# EAGLE design 1W_FM_TRX_DRA818V (EAGLE 9.4.2)
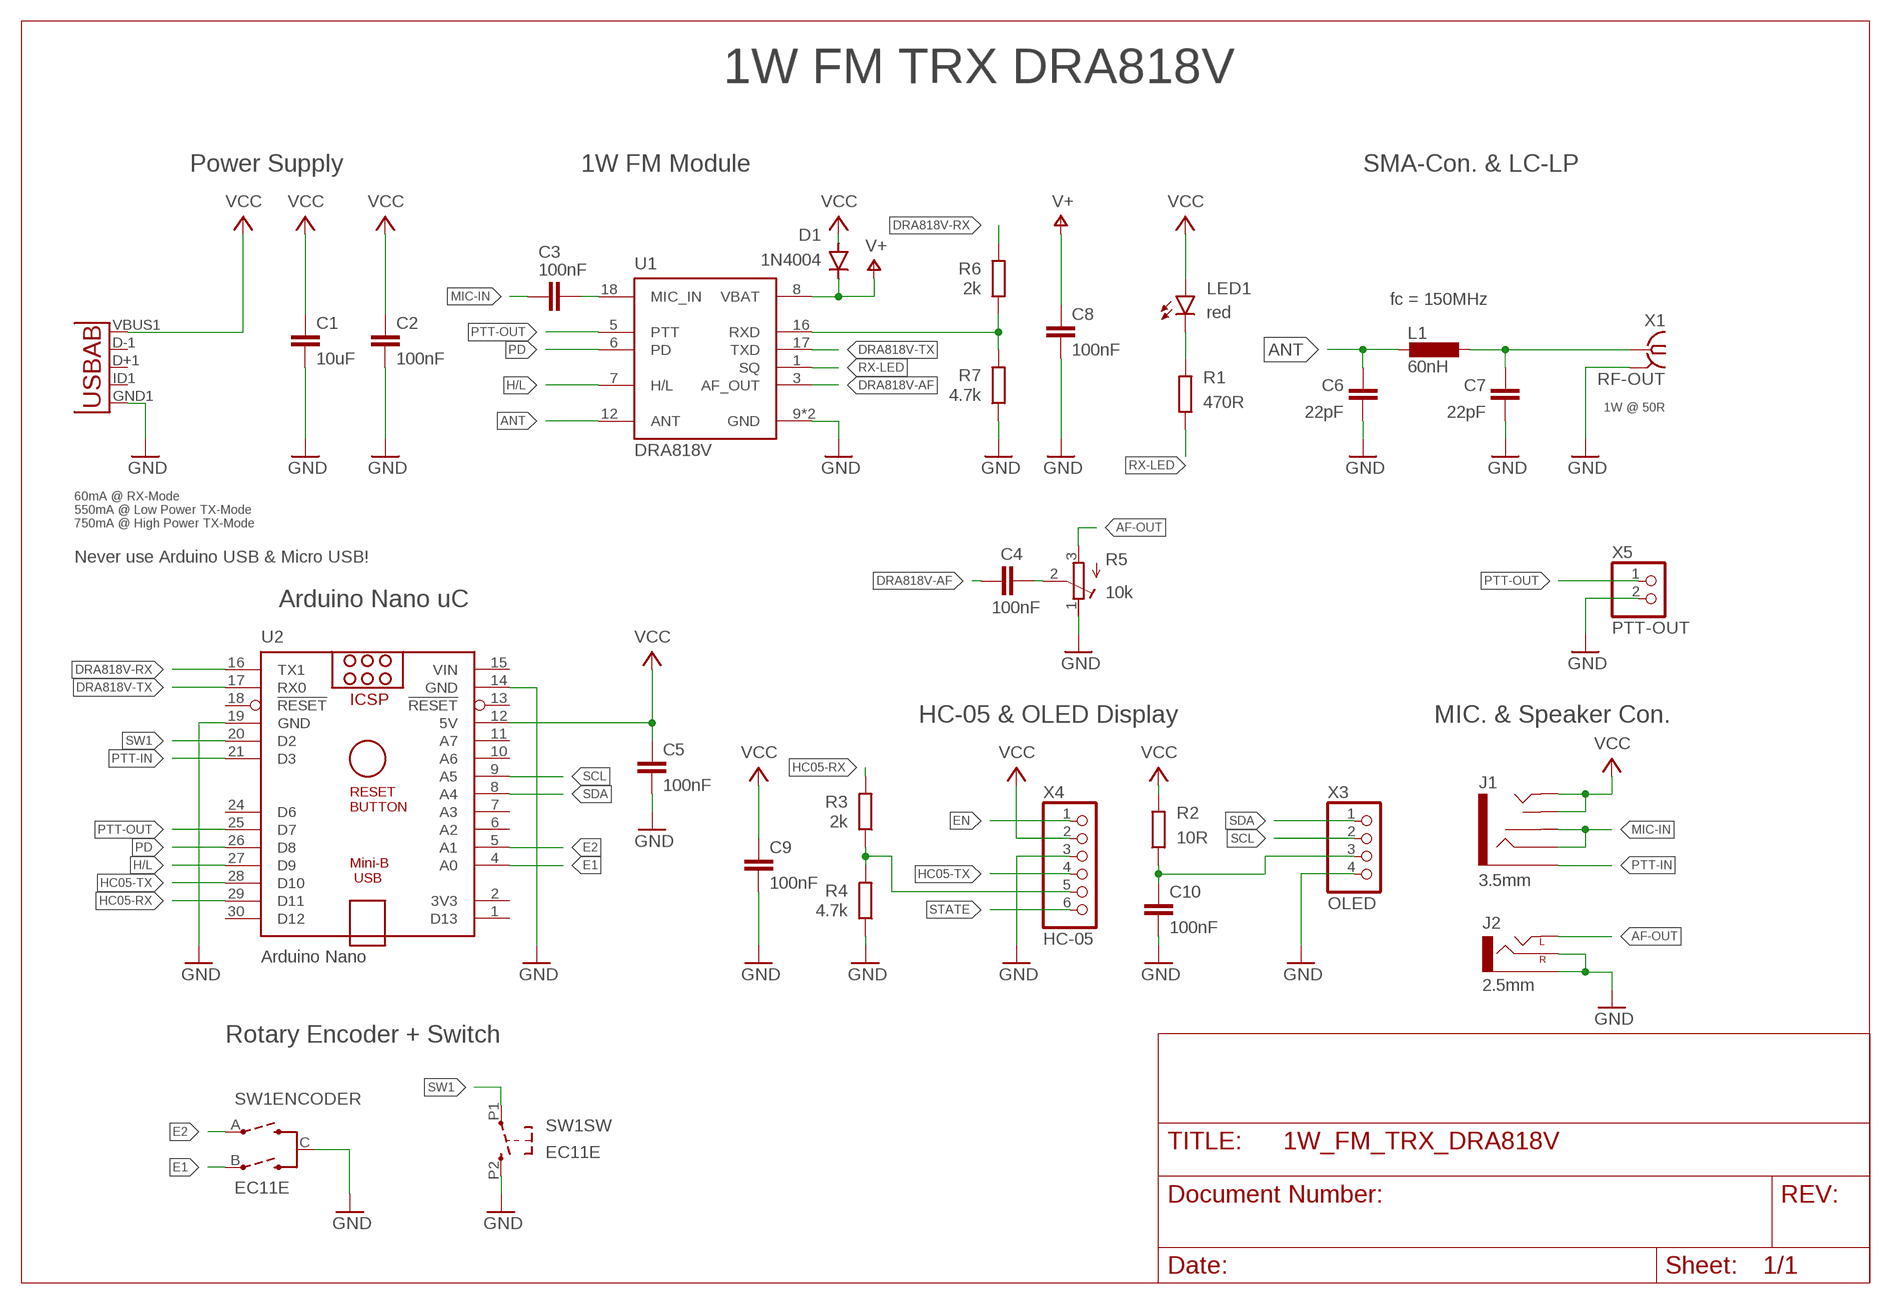
[diagram p0: schematic, sheet 1]

## Parts
C1  10uF  C-EUC0805K  [C0805K]
C2  100nF  C-EUC0805K  [C0805K]
C3  100nF  C-EUC0805K  [C0805K]
C4  100nF  C-EUC0805K  [C0805K]
C5  100nF  C-EUC0805K  [C0805K]
C6  22pF  C-EUC0805K  [C0805K]
C7  22pF  C-EUC0805K  [C0805K]
C8  100nF  C-EUC0805K  [C0805K]
C9  100nF  C-EUC0805K  [C0805K]
C10  100nF  C-EUC0805K  [C0805K]
D1  1N4004  [DO41-10]
J1  3.5mm  AUDIO_JACK_3.5MM_PTH  [AUDIO-JACK]
J2  2.5mm  AUDIO_JACK_2.5MM_2.5MM  [STEREOJACK2.5MM_STEREOJACK2.5MM]
L1  60nH  L-EUL8530M  [L8530M]
LED1  red  LEDCHIP-LED0805  [CHIP-LED0805]
R1  470R  R-EU_R0805  [R0805]
R2  10R  R-EU_R0805  [R0805]
R3  2k  R-EU_R0805  [R0805]
R4  4.7k  R-EU_R0805  [R0805]
R5  10k  R-TRIMM3314J  [RTRIM3314J]
R6  2k  R-EU_R0805  [R0805]
R7  4.7k  R-EU_R0805  [R0805]
SW1  EC11E  ENCODER_SW1-PEC12  [EC11E_INCREMENTAL_ENCODER]
U1  DRA818V  [DORJI_DRA818V]
U2  Arduino Nano  ARDUINO_NANO  [ARDUINO_NANO]
U3  USB Micro  USB""  [USB-MICRO-SMD]
X1  RF-OUT  SMA-PCB-CON142-0711-821/826  [J502-ND-142-0711-821/826]
X3  OLED  PINHD-1X4  [1X04]
X4  HC-05  PINHD-1X6  [1X06]
X5  PTT-OUT  PINHD-1X2  [1X02]

## Nets
AF-OUT: J2.SHIELD(LEFT) R5.3(A)
ANT: C6.2 L1.2 U1.12(ANT)
DRA818V-AF: C4.1 U1.3(AF_OUT)
DRA818V-RX: R6.2 U2.16(TX1)
DRA818V-TX: U1.17(TXD) U2.17(RX0)
E1: SW1.B(ENCODER:B) U2.4(A0)
E2: SW1.A(ENCODER:A) U2.5(A1)
EN: X4.1
GND: C1.2 C2.2 C5.2 C6.1 C7.1 C8.1 C9.2 C10.2 J2.RING1(SLEEVE) J2.TIP(RIGHT) R4.1 R5.1(E) R7.1 SW1.C(ENCODER:C) SW1.P2 U1.9(GND) U1.10(GND) U2.14(GND) U2.19(GND) U3.GND1(GND) X1.G@1(GND) X1.G@2(GND) X1.G@3(GND) X1.G@4(GND) X3.4 X4.3 X5.2
H/L: U1.7(H/L) U2.27(D9)
HC05-RX: R3.2 U2.29(D11)
HC05-TX: U2.28(D10) X4.4
MIC-IN: C3.1 J1.RING J1.RSH
N$1: C3.2 U1.18(MIC_IN)
N$3: R3.1 R4.2 X4.5
N$4: LED1.C R1.2
N$6: C4.2 R5.2(S)
N$7: C7.2 L1.1 X1.1(RF)
N$8: C10.1 R2.1 X3.3
N$10: R6.1 R7.2 U1.16(RXD)
PD: U1.6(PD) U2.26(D8)
PTT-IN: J1.SLEEVE U2.21(D3)
PTT-OUT: U1.5(PTT) U2.25(D7) X5.1
RX-LED: R1.1 U1.1(SQ)
SCL: U2.9(A5) X3.2
SDA: U2.8(A4) X3.1
STATE: X4.6
SW1: SW1.P1 U2.20(D2)
V+: C8.2 D1.C U1.8(VBAT)
VCC: C1.1 C2.1 C5.1 C9.1 D1.A J1.TIP J1.TSH LED1.A R2.2 U2.12(5V) U3.VBUS1(VBUS) X4.2
Unconnected: U2.1(D13) U2.2(3V3) U2.6(A2) U2.7(A3) U2.10(A6) U2.11(A7) U2.13(!RESET) U2.18(!RESET) U2.24(D6) U2.30(D12) U3.D+1(D+) U3.D-1(D-) U3.ID1(USBID)

## Notes on the sheet
- 1W FM TRX DRA818V
- Power Supply | 1W FM Module | SMA-Con. & LC-LP
- fc = 150MHz
- 1W @ 50R
- 60mA @ RX-Mode
  550mA @ Low Power TX-Mode
  750mA @ High Power TX-Mode
- Never use Arduino USB & Micro USB!
- Arduino Nano uC
- HC-05 & OLED Display | MIC. & Speaker Con.
- Rotary Encoder + Switch

## Power pins joined to a net without a drawn wire
VIN: U2.15(VIN)

## Library data of the parts
C1-C10 = rcl:C-EU: CAPACITOR, European symbol; SPICEPREFIX: C
D1 = diode:1N4004: DIODE general purpose rectifier, 1 A
J1 = SparkFun-Connectors:AUDIO_JACK_3.5MM: Audio Jack 3.5mm variants of PTH and SMT stereo audio jack with bypass switches. SparkFun Products: SparkFun SparkPunk Sound Kit <[https://www.sparkfun.com/products/11177]> - PTH MP3 Trigger <https://www.sparkfun.com/products/13720> -3.5mm SMD SparkFun PicoBoard <https://www.sparkfun.com/products/11888>- 2.5mm SMD; PROD_ID: CONN-08774; SF_ID: PRT-08032
J2 = SparkFun-Connectors:AUDIO_JACK_2.5MM: Audio Jack 2.5mm variants of PTH and SMT audio jacks. SparkFun Products: SparkFun PicoBoard <https://www.sparkfun.com/products/11888>- 2.5mm SMD; PROD_ID: CONN-09878
L1 = rcl:L-EU: INDUCTOR, European symbol; SPICEPREFIX: L
LED1 = led:LED: LED OSRAM: - CHIPLED LG R971, LG N971, LY N971, LG Q971, LY Q971, LO R971, LY R971 LH N974, LH R974 LS Q976, LO Q976, LY Q976 LO Q996 - Hyper CHIPLED LW Q18S LB Q993, LB Q99A, LB R99A - SideLED LS A670, LO A670, LY A670, LG A670, LP A670 LB A673, LV A673, LT A673, LW A673 LH A674 LY A675 LS A676, LA A676, LO A676, LY A676, LW A676 LS A679, LY A679, LG A679 - Hyper Micro SIDELED® LS Y876, LA Y876, LO Y876, LY Y876 LT Y87S - SmartLED LW L88C, LW L88S LB L89C, LB L89S, LG L890 LS L89K, LO L89K, LY L89K LS L896, LA L896, LO L896, LY L896 - TOPLED LS T670, LO T670, LY T670, LG T670, LP T670 LSG T670, LSP T670, LSY T670, LOP T670, LYG T670 LG T671, LOG T671, LSG T671 LB T673, LV T673, LT T673, LW T673 LH T674 LS T676, LA T676, LO T676, LY T676, LB T676, LH T676, LSB T676, LW T676 LB T67C, LV T67C, LT T67C, LS T67K, LO T67K, LY T67K, LW E67C LS E67B, LA E67B, LO E67B, LY E67B, LB E67C, LV E67C, LT E67C LW T67C LS T679, LY T679, LG T679 LS T770, LO T770, LY T770, LG T770, LP T770 LB T773, LV T773, LT T773, LW T773 LH T774 LS E675, LA E675, LY E675, LS T675 LS T776, LA T776, LO T776, LY T776, LB T776 LHGB T686 LT T68C, LB T68C - Hyper Mini TOPLED® LB M676 - Mini TOPLED Santana® LG M470 LS M47K, LO M47K, LY M47K Source: http://www.osram.convergy.de LUXEON: - LUMILED® LXK2-PW12-R00, LXK2-PW12-S00, LXK2-PW14-U00, LXK2-PW14-V00 LXK2-PM12-R00, LXK2-PM12-S00, LXK2-PM14-U00 LXK2-PE12-Q00, LXK2-PE12-R00, LXK2-PE12-S00, LXK2-PE14-T00, LXK2-PE14-U00 LXK2-PB12-K00, LXK2-PB12-L00, LXK2-PB12-M00, LXK2-PB14-N00, LXK2-PB14-P00, LXK2-PB14-Q00 LXK2-PR12-L00, LXK2-PR12-M00, LXK2-PR14-Q00, LXK2-PR14-R00 LXK2-PD12-Q00, LXK2-PD12-R00, LXK2-PD12-S00 LXK2-PH12-R00, LXK2-PH12-S00 LXK2-PL12-P00, LXK2-PL12-Q00, LXK2-PL12-R00 Source: www.luxeon.com KINGBRIGHT: KA-3528ASYC Source: www.kingbright.com
R1-R4 R6 R7 = rcl:R-EU_: RESISTOR, European symbol; SPICEPREFIX: R
R5 = rcl:R-TRIMM: Trimm resistor; SPICEMODEL: X; SPICEPREFIXL: POT
SW1 = Ham Radio:ENCODER_SW1: Incremental Encoder with push switch
U1 = Ham Radio:DRA818V: VHF Band Voice Transceiver Module; AVAILABILITY: Unavailable; MF: DORJI; MP: DRA818V; PACKAGE: Package Analog Devices; PRICE: None
U2 = ArduinoNanoModified:ARDUINO_NANO: Arduino Nano V3.0 Overview: The Arduino Nano is a small, complete, and breadboard-friendly board based on the ATmega328 (Arduino Nano 3.x) or ATmega168 (Arduino Nano 2.x). It has more or less the same functionality of the Arduino Duemilanove, but in a different package. It lacks only a DC power jack, and works with a Mini-B USB cable instead of a standard one. The Nano was designed and is being produced by Gravitech. Specifications: Microcontroller Atmel ATmega168 or ATmega328 Operating Voltage (logic level) 5 V Input Voltage (recommended) 7-12 V Input Voltage (limits) 6-20 V Digital I/O Pins 14 (of which 6 provide PWM output) Analog Input Pins 8 DC Current per I/O Pin 40 mA Flash Memory 16 KB (ATmega168) or 32 KB (ATmega328) of which 2 KB used by bootloader SRAM 1 KB (ATmega168) or 2 KB (ATmega328) EEPROM 512 bytes (ATmega168) or 1 KB (ATmega328) Clock Speed 16 MHz Dimensions 0.73" x 1.70" Length 45 mm Width 18 mm Weigth 5 g Power: The Arduino Nano can be powered via the Mini-B USB connection, 6-20V unregulated external power supply (pin 30), or 5V regulated external power supply (pin 27). The power source is automatically selected to the highest voltage source. Memory: The ATmega168 has 16 KB of flash memory for storing code (of which 2 KB is used for the bootloader); the ATmega328 has 32 KB, (also with 2 KB used for the bootloader). The ATmega168 has 1 KB of SRAM and 512 bytes of EEPROM (which can be read and written with the EEPROM library); the ATmega328 has 2 KB of SRAM and 1 KB of EEPROM. Input and Output: Each of the 14 digital pins on the Nano can be used as an input or output, using pinMode(), digitalWrite(), and digitalRead() functions. They operate at 5 volts. Each pin can provide or receive a maximum of 40 mA and has an internal pull-up resistor (disconnected by default) of 20-50 kOhms. In addition, some pins have specialized functions. Visit Arduino - ArduinoBoardNano <https://www.arduino.cc/en/Main/ArduinoBoardNano>
U3 = MicroUSB:USB: This is a USB AB connector that is compatible with USB OTG. i.e. this connector can serve as a host or device
X1 = Ham Radio:SMA-PCB-CON: SMA 50 Ohm End Launch Jack Receptacle - Round Contact Johnson Components Source: www.johnsoncomponents.com .. J502-ND.pdf; MF: JOHNSON COMPONENTS; MPN: 142-0711-821; OC_FARNELL: 1019328; OC_NEWARK: 16F3627
X3 = pinhead:PINHD-1X4: PIN HEADER
X4 = pinhead:PINHD-1X6: PIN HEADER
X5 = pinhead:PINHD-1X2: PIN HEADER

## Board
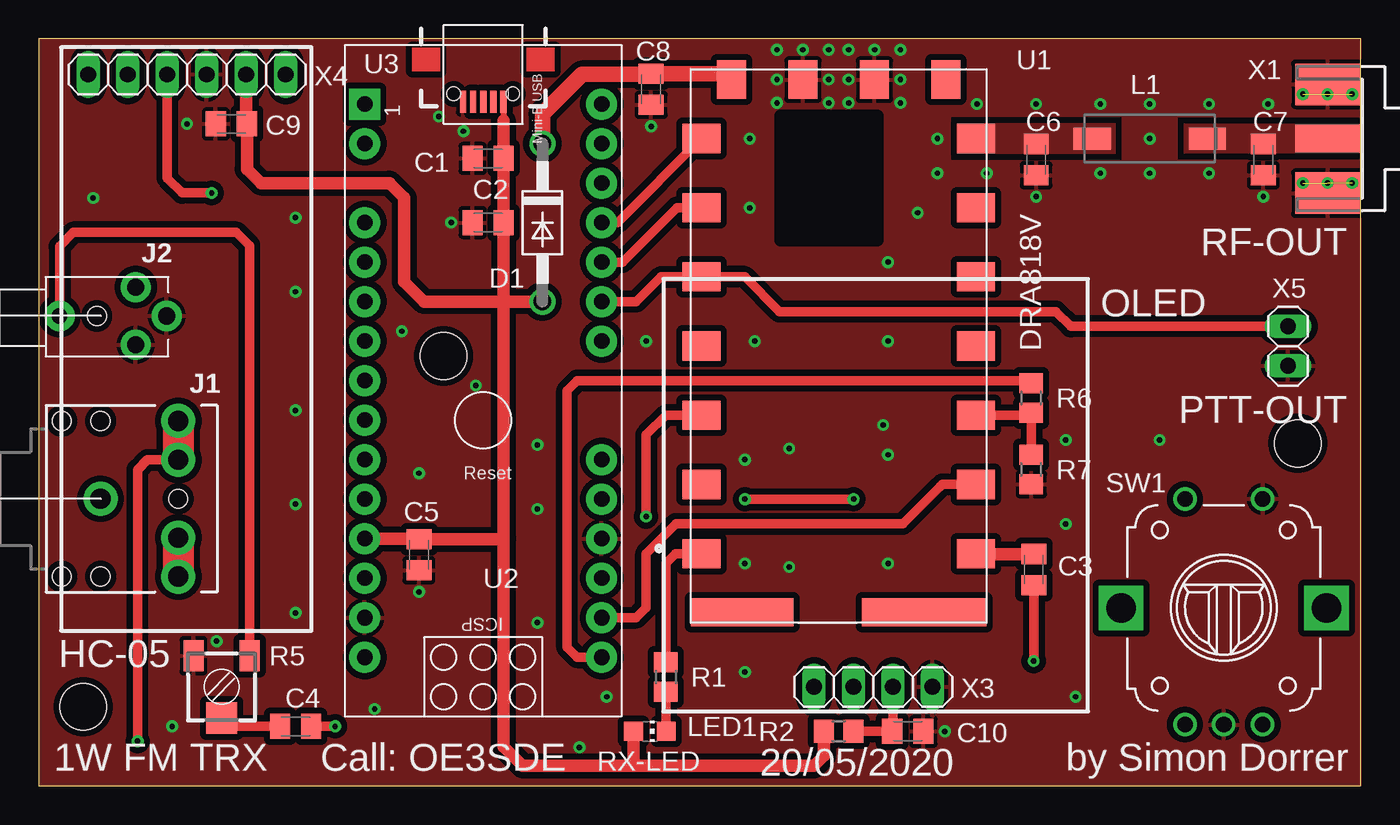
[diagram p1: board, top side]
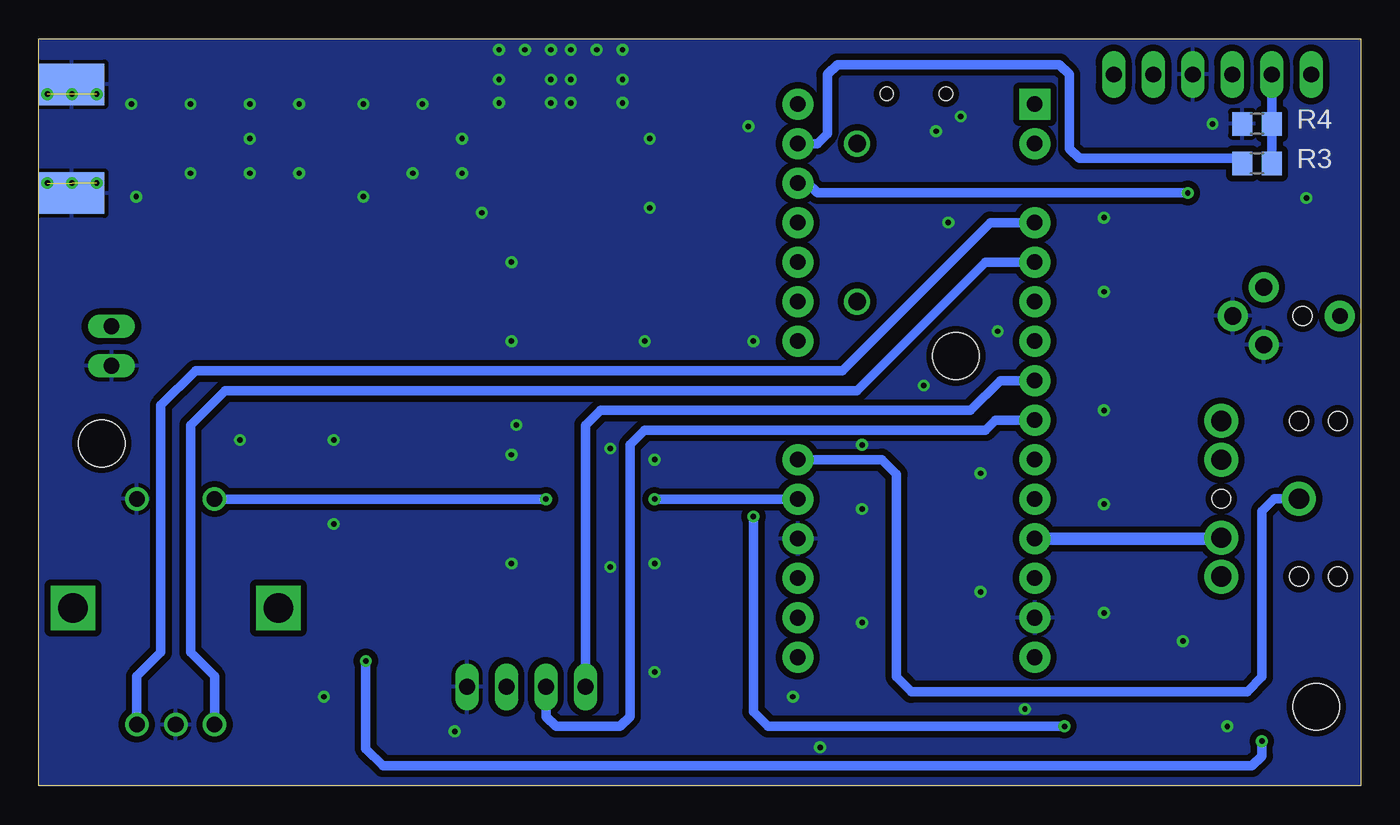
[diagram p2: board, bottom side, seen from below]

Size 85 x 48 mm. Coordinates in mm from the lower left corner, seen from the top.
Outline: 0,0 85,0 85,48 0,48 0,0
Copper layers (1*16): Top 0.035mm / dielectric 1.5mm / Bottom 0.035mm
Design rules "default *": minimum track width 6mil, minimum drill 0.35mm, track to track 6mil, track to pad 6mil, pad to pad 6mil, via to via 6mil, smd to smd 6mil, copper to edge 0mil, drill to drill 6mil, minimum pad ring 10mil, minimum via ring 8mil, stop-mask expansion 4mil, vias tented up to drill 0mil, thermal gap 10mil
Holes 3 mm at 2.86,5.08 80.96,22 26.04,27.62

### Footprints (pad centres in the part's own frame; a part is rotated, then mirrored left to right if it is on the bottom)
C0805K = smd 1.3 x 1.6: 1 -1,0; 2 1,0
DO41-10 = drill 1.118: A 5.08,0; C -5.08,0
AUDIO-JACK = drill 1.3 pad 2.184: RING 5,5; RSH 5,2.5; SLEEVE 0,0; TIP 5,-5; TSH 5,-2.5 | hole 1.2: 0,5; -2.5,5; -2.5,-5; 0,-5; 5,0
STEREOJACK2.5MM_STEREOJACK2.5MM = drill 1.1 pad 1.93: RING1 2.5,-1.85; RING2 2.5,1.85; TIP 4.5,0 | drill 1 pad 1.93: SHIELD -2.4,0 | hole 1.2: 0,0
L8530M = smd 2.4 x 1.4: 1 -3.7,0; 2 3.7,0
CHIP-LED0805 = smd 1.2 x 1.2: A 0,-1.05; C 0,1.05
R0805 = smd 1.3 x 1.5: 1 -0.95,0; 2 0.95,0
RTRIM3314J = smd 1.3 x 2: 1 1.8,-2; 3 -1.8,-2 | smd 2 x 2: 2 0,2
EC11E_INCREMENTAL_ENCODER = drill 1: A -2.5,-7.5; B 2.5,-7.5; C 0,-7.5; P1 -2.5,7; P2 2.5,7 | drill 1.9 square: GND@1 -6.6,0; GND@2 6.6,0
DORJI_DRA818V = smd 1.88 x 2.47: 1 -13.35,8.825; 2 -8.9,8.825; 3 -4.45,8.825; 4 0,8.825; 5 4.45,8.825; 6 8.9,8.825; 7 13.35,8.825; 12 13.35,-8.825; 13 8.9,-8.825; 14 4.45,-8.825; 15 0,-8.825; 16 -4.45,-8.825; 17 -8.9,-8.825; 18 -13.35,-8.825 | smd 2.47 x 1.88: 8 17.125,6.9; 9 17.125,2.3; 10 17.125,-2.3; 11 17.125,-6.9 | smd 1.8 x 6.6: P2 -17.125,6.2 | smd 1.8 x 8: P3 -17.125,-5.5
ARDUINO_NANO = drill 1 pad 2 square: 1 -20.32,-7.62 | drill 1 pad 2: 2 -17.78,-7.62; 4 -12.7,-7.62; 5 -10.16,-7.62; 6 -7.62,-7.62; 7 -5.08,-7.62; 8 -2.54,-7.62; 9 0,-7.62; 10 2.54,-7.62; 11 5.08,-7.62; 12 7.62,-7.62; 13 10.16,-7.62; 14 12.7,-7.62; 15 15.24,-7.62; 16 15.24,7.62; 17 12.7,7.62; 18 10.16,7.62; 19 7.62,7.62; 20 5.08,7.62; 21 2.54,7.62; 24 -5.08,7.62; 25 -7.62,7.62; 26 -10.16,7.62; 27 -12.7,7.62; 28 -15.24,7.62; 29 -17.78,7.62; 30 -20.32,7.62
USB-MICRO-SMD = smd 1.4 x 0.4: D+1 2.7,0; D-1 2.7,0.65; GND1 2.7,-1.3; ID1 2.7,-0.65; VBUS1 2.7,1.3 | hole 0.85: 2.2,1.9; 2.2,-1.9
J502-ND-142-0711-821/826 = smd 4.191 x 1.778: 1 2.115,0 | smd 4.191 x 2.667: G@1 2.115,3.495; G@2 2.115,-3.495 | smd 4.191 x 2.667 bottom: G@3 2.115,3.495; G@4 2.115,-3.495
1X04 = drill 1.016 long: 1 -3.81,0; 2 -1.27,0; 3 1.27,0; 4 3.81,0
1X06 = drill 1.016 long: 1 -6.35,0; 2 -3.81,0; 3 -1.27,0; 4 1.27,0; 5 3.81,0; 6 6.35,0
1X02 = drill 1.016 long: 1 -1.27,0; 2 1.27,0

### Placement (x,y rotation side)
C1  28.89,40.32 180 top
C2  28.89,36.2 180 top
C3  63.98,13.89 90 top
C4  16.51,3.81 180 top
C5  24.45,14.84 270 top
C6  64.14,40.24 90 top
C7  78.74,40.24 90 top
C8  39.37,44.77 90 top
C9  12.38,42.55 180 top
C10  55.88,3.49 0 top
D1  32.38,36.2 270 top
J1  3.96,18.44 0 top
J2  3.73,30.19 0 top
L1  71.44,41.59 180 top
LED1  39.29,3.49 270 top
R1  40.32,6.99 270 top
R2  51.44,3.49 180 top
R3  6.67,40.01 180 bottom
R4  6.67,42.55 0 bottom
R5  11.75,6.35 180 top
R6  63.82,24.92 90 top
R7  63.82,20.32 90 top
SW1  76.2,11.43 0 top
U1  51.44,28.26 90 top
U2  28.57,23.5 270 top
U3  28.57,46.67 270 top
X1  85,41.59 180 top
X3  53.66,6.35 0 top
X4  9.53,45.72 180 top
X5  80.33,28.26 270 top

### Tracks (layer width: path | path; a pad name or v marks a point on that pad's centre or on a via)
AF-OUT
  Top 0.6: R5.3 13.55,34.71 12.7,35.56 2.22,35.56 1.33,34.67 J2.SHIELD
ANT
  pour Top (isolate 0.7, no thermals): 59.05,42.55 59.05,40.64 69.22,40.64 69.22,42.55
DRA818V-AF  (via drill 0.35)
  Top 0.6: U1.3 40.32,23.81 39.05,22.54 v39.05,17.3 | v19.05,3.81 C4.1
  Bottom 0.6: v39.05,17.3 39.05,4.76 38.1,3.81 v19.05,3.81
DRA818V-RX
  Top 0.6: U2.16 34.61,8.26 33.97,8.89 33.97,25.4 34.61,26.04 63.5,26.04 63.82,25.72 R6.2
DRA818V-TX
  Top 0.6: U2.17 38.42,10.79 39.05,11.43 39.05,14.92 40.96,16.83 55.56,16.83 57.94,19.21 58.09,19.36 58.1,19.37 60.96,19.37 60.95,19.36 U1.17
E1
  Bottom 0.6: SW1.B 78.7,7.03 77.15,8.57 77.15,24.45 74.93,26.67 33.34,26.67 23.81,36.2 U2.4
E2
  Bottom 0.6: SW1.A 73.7,7.03 75.25,8.57 75.25,23.18 73.03,25.4 32.38,25.4 24.13,33.66 U2.5
GND  (via drill 0.35)  (4 unrouted)
  other vias: 9.53,42.55 84.45,44.45 82.87,44.45 81.28,44.45 81.28,38.73 82.87,38.73 84.45,38.73 78.74,37.86 64.14,37.86 79.06,43.81 75.25,43.81 68.26,43.81 71.44,41.59 71.44,43.81 64.14,43.81 60.33,43.81 57.78,41.59 57.78,39.37 60.96,39.37 68.26,39.37 71.44,39.37 75.25,39.37 39.37,42.39 27.3,42.07 25.72,43.02 24.45,12.46 58.26,3.49 11.43,9.29 47.47,45.4 50.8,45.4 52.07,45.4 55.4,45.4 52.07,43.89 47.47,43.89 53.74,47.31 49.13,47.31 47.47,47.31 50.8,47.31 50.8,43.89 52.07,47.31 55.4,47.31 55.4,43.89 3.49,37.78 16.51,31.75 16.51,24.13 16.51,18.1 16.51,11.11 32.07,17.78 32.07,10.48 36.51,5.71 66.04,22.23 72.07,22.23 66.67,5.71 54.61,14.29 54.61,21.27 54.29,23.18 54.61,28.57 54.61,33.66 56.52,36.83 45.72,41.59 45.72,37.15 46.04,28.57 45.4,14.29 45.4,7.3 66.04,16.83 8.57,3.81 21.59,4.92 34.77,2.46 45.4,20.95 24.45,20.08 16.51,36.51 39.05,28.57 32.07,21.91 26.51,36.2 48.26,21.67 48.26,14.05 23.34,29.21 28.1,25.72
  pour Top (isolate 0.4, rank 2): 0,0 0,48 85,48 85,0
  pour Bottom (isolate 0.4, rank 2): 0,0 0,48 85,48 85,0
H/L
  Top 0.6: U1.7 37.2,36.2 U2.27
HC05-RX
  Bottom 0.6: R3.2 7.93,40.32 18.1,40.32 18.73,40.96 18.73,45.72 19.37,46.35 33.66,46.35 34.29,45.72 34.29,41.91 34.92,41.27 U2.29
HC05-TX  (via drill 0.35)
  Top 0.6: X4.4 8.26,39.05 9.21,38.1 v11.11,38.1
  Bottom 0.6: U2.28 35.56,38.73 34.92,38.1 v11.11,38.1
MIC-IN  (via drill 0.35)
  Top 0.6: J1.RSH 6.97,20.94 6.35,20.32 v6.35,2.86 | C3.1 v63.98,8.02
  Top 2: J1.RING J1.RSH
  Bottom 0.6: v63.98,8.02 63.98,2.38 62.87,1.27 6.99,1.27 6.35,1.91 v6.35,2.86
N$1
  Top 0.8: C3.2 59.72,14.89 59.69,14.92 60.24,14.92 U1.18
N$3
  Bottom 0.6: X4.5 R4.2 R3.1
N$4
  Top 0.6: R1.2 40.34,6.02 LED1.C
N$6
  Top 0.6: C4.2 12.29,3.81 R5.2
N$7
  pour Top (isolate 0.7, no thermals): 85.01,40.64 73.66,40.64 73.66,42.55 85.01,42.55
N$8
  Top 0.6: X3.3 54.93,3.54 C10.1 R2.1
N$10
  Top 0.6: U1.16 63.65,23.81 R6.1 R7.2
PD
  Top 0.6: U1.6 41.02,37.16 37.52,33.66 U2.26
PTT-IN
  Bottom 0.6: J1.SLEEVE 5.55,18.44 6.35,17.64 6.35,6.99 7.3,6.03 28.89,6.03 29.84,6.99 29.84,20 30.8,20.95 U2.21
PTT-OUT
  Top 0.6: X5.1 66.36,29.53 65.41,30.48 47.62,30.48 45.4,32.71 U1.5 40.01,32.71 38.42,31.11 U2.25
RX-LED
  Top 0.6: U1.1 40.94,14.91 40.32,14.29 R1.1
SCL
  Bottom 0.6: X3.2 52.39,4.45 51.75,3.81 47.62,3.81 46.99,4.45 46.99,21.91 46.04,22.86 24.13,22.86 23.5,23.5 U2.9
SDA
  Bottom 0.6: X3.1 49.85,23.18 48.9,24.13 25.08,24.13 23.18,26.04 U2.8
SW1  (via drill 0.35)
  Top 0.6: v45.4,18.41 v52.39,18.41
  Bottom 0.6: v52.39,18.41 73.69,18.41 SW1.P1 | v45.4,18.41 U2.20
V+
  Top 1: U1.8 44.15,45.77 C8.2 39.32,45.72 34.92,45.72 32.38,43.18 D1.C
VCC
  Top 0.4: U3.VBUS1 29.88,42.73
  Top 0.8: X4.2 13.34,42.59 C9.1 13.38,39.64 14.29,38.73 22.54,38.73 23.5,37.78 23.5,32.38 24.77,31.11 29.89,31.11 | 29.89,39.69 C2.1 29.89,31.11 | 29.89,39.69 C1.1 | 29.89,15.88 29.89,2.49 31.11,1.27 38.42,1.27 | 29.89,15.88 29.89,31.11 | D1.A 29.89,31.11 | 29.88,42.73 29.88,39.7 29.89,39.69 | R2.2 50.48,1.91 49.85,1.27 38.42,1.27 | LED1.A 38.24,1.45 38.42,1.27 | U2.12 24.42,15.88 C5.1 29.86,15.84 29.89,15.88
  Top 2: J1.TSH J1.TIP
  Bottom 0.8: U2.12 9.03,15.88 J1.TSH

### Text on the board
tNames: RF-OUT | OLED | DRA818V | PTT-OUT | HC-05 | 1W FM TRX | Call: OE3SDE | RX-LED | 20/05/2020 | by Simon Dorrer